# Altium schematic sheet Power_main_DCDC.SchDoc: =DocumentName
size A4; DocumentNumber: 1; Revision: 0; SheetNumber: 1; SheetTotal: 18; Last modified by: Maciej Przybysz
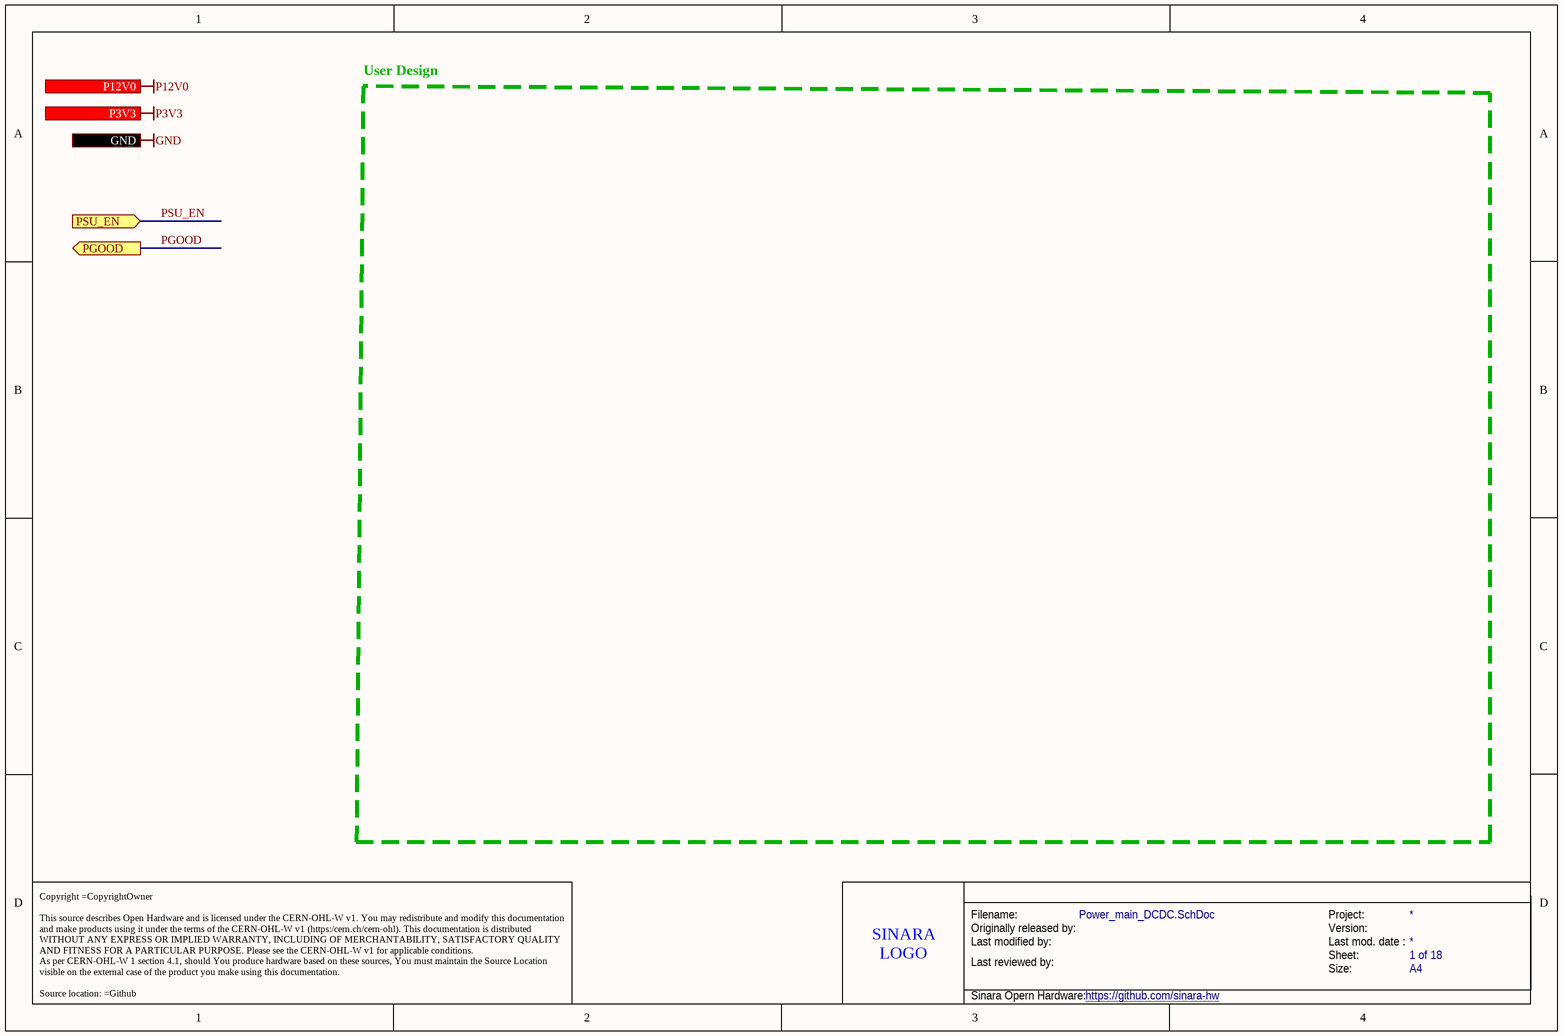
[diagram p0: Power_main_DCDC.SchDoc]

## Ports
GND, P3V3 (out), P12V0 (in), PGOOD (out), PSU_EN (in)

## Nets
GND: port GND
P3V3: port P3V3
P12V0: port P12V0
PGOOD: port PGOOD
PSU_EN: port PSU_EN

## Notes on the sheet
- User Design
- Filename:
- Project:
- SINARA
  LOGO
  TBD
- Originally released by:
- Last modified by:
- Last reviewed by:
- Size:
- Version:
- Last mod. date :
- Sheet:
- A4
- Copyright =CopyrightOwner
  This source describes Open Hardware and is licensed under the CERN-OHL-W v1. You may redistribute and modify this documentation and make products using it under the terms of the CERN-OHL-W v1 (https:/cern.ch/cern-ohl). This documentation is distributed WITHOUT ANY EXPRESS OR IMPLIED WARRANTY, INCLUDING OF MERCHANTABILITY, SATISFACTORY QUALITY AND FITNESS FOR A PARTICULAR PURPOSE. Please see the CERN-OHL-W v1 for applicable conditions.
  As per CERN-OHL-W 1 section 4.1, should You produce hardware based on these sources, You must maintain the Source Location visible on the external case of the product you make using this documentation.
  Source location: =Github
- Sinara Opern Hardware:
- https://github.com/sinara-hw